# EAGLE design braeburn1 (EAGLE 6.1)
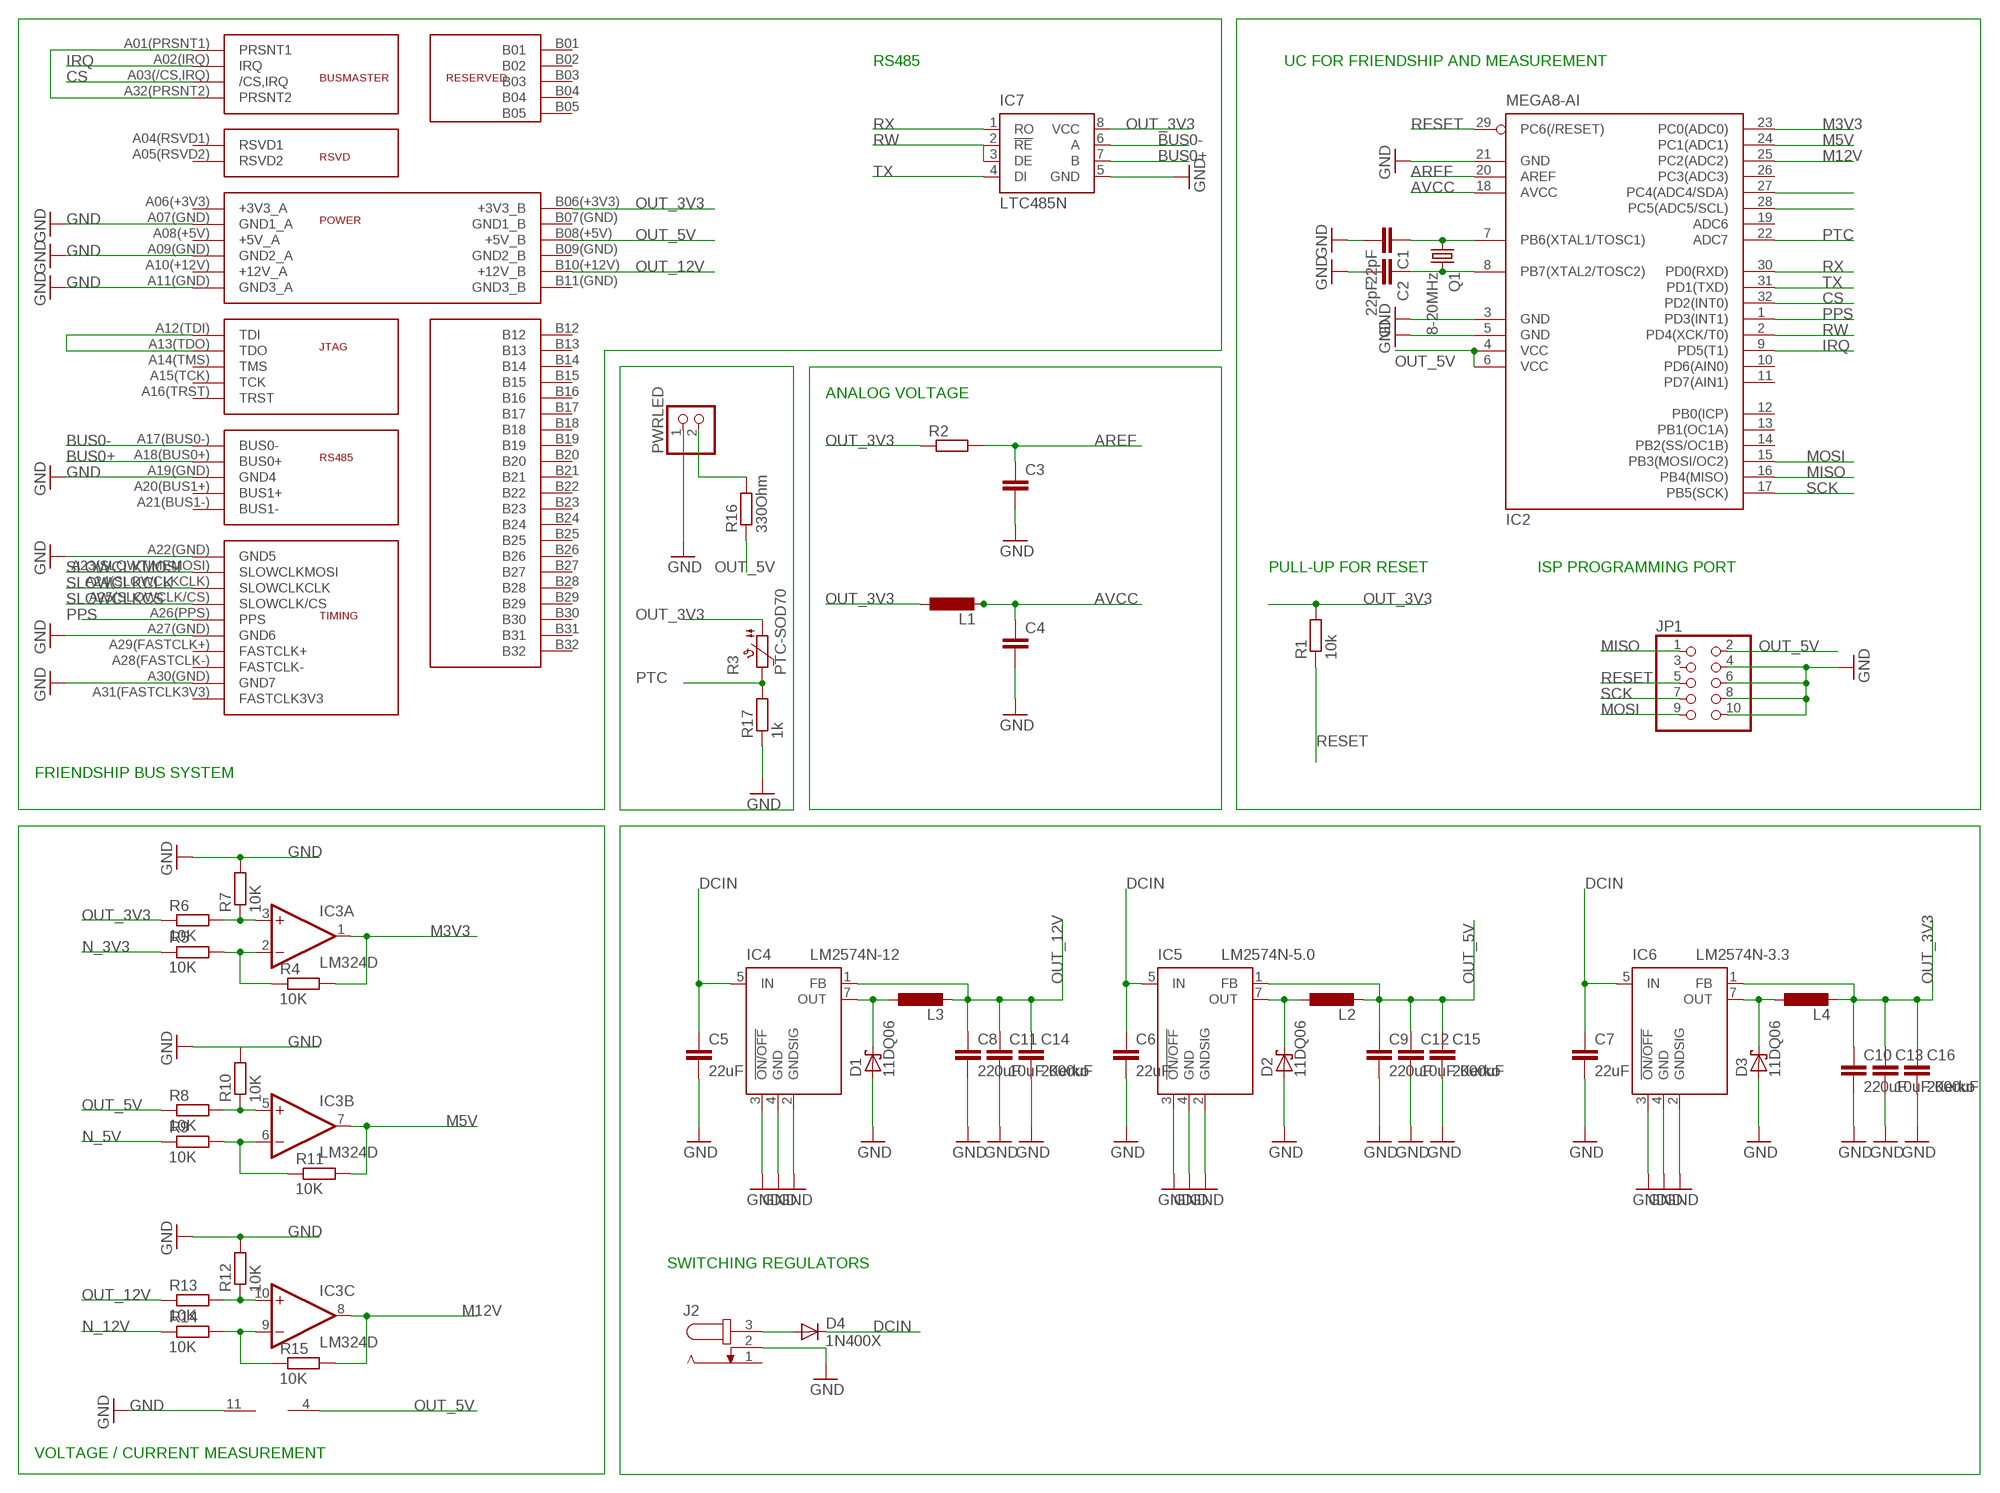
[diagram p0: schematic, sheet 1]

## Parts
C1  22pF  C-EUC0603  [C0603]
C2  22pF  C-EUC0603  [C0603]
C3  C-EUC0603  [C0603]
C4  C-EUC0603  [C0603]
C5  22uF  C-EU025-050X050  [C025-050X050]
C6  22uF  C-EU025-050X050  [C025-050X050]
C7  22uF  C-EU025-050X050  [C025-050X050]
C8  220uF  C-EU025-050X050  [C025-050X050]
C9  220uF  C-EU025-050X050  [C025-050X050]
C10  220uF  C-EU025-050X050  [C025-050X050]
C11  10uF Kerko  C-EUC0603  [C0603]
C12  10uF Kerko  C-EUC0603  [C0603]
C13  10uF Kerko  C-EUC0603  [C0603]
C14  2000uF  C-EU050-075X075  [C050-075X075]
C15  2000uF  C-EU050-075X075  [C050-075X075]
C16  2000uF  C-EU050-075X075  [C050-075X075]
D1  11DQ06  1N5817-B  [DO41-7.6]
D2  11DQ06  1N5817-B  [DO41-7.6]
D3  11DQ06  1N5817-B  [DO41-7.6]
D4  1N400X  1N4004  [DO41-10]
IC2  MEGA8-AI  [TQFP32-08]
IC3  LM324D  [SO14]
IC4  LM2574N-12  [DIL08]
IC5  LM2574N-5.0  [DIL08]
IC6  LM2574N-3.3  [DIL08]
IC7  LTC485N  [DIL08]
J2  JACK-PLUG0  [SPC4077]
JP1  PINHD-2X5  [2X05]
L1  L-EU0207/5V  [0207/5V]
L2  L-EUPIS2816  [PIS2816]
L3  L-EUPIS2816  [PIS2816]
L4  L-EUPIS2816  [PIS2816]
PWRLED  PINHD-1X2  [1X02]
Q1  8-20MHz  CRYSTALHC49S  [HC49/S]
R1  10k  R-EU_R0603  [R0603]
R2  R-EU_R0603  [R0603]
R3  PTC-SOD70  [SOD70]
R4  10K  R-EU_R0603  [R0603]
R5  10K  R-EU_R0603  [R0603]
R6  10K  R-EU_R0603  [R0603]
R7  10K  R-EU_R0603  [R0603]
R8  10K  R-EU_R0603  [R0603]
R9  10K  R-EU_R0603  [R0603]
R10  10K  R-EU_R0603  [R0603]
R11  10K  R-EU_R0603  [R0603]
R12  10K  R-EU_R0603  [R0603]
R13  10K  R-EU_R0603  [R0603]
R14  10K  R-EU_R0603  [R0603]
R15  10K  R-EU_R0603  [R0603]
R16  330Ohm  R-EU_R0603  [R0603]
R17  1k  R-EU_0207/12  [0207/12]
U$1  FRIENDSHIPCONNECTOR  [FRIENDSHIP_EDGE_CONNECTOR]

## Nets
AREF: C3.1 IC2.20(AREF) R2.2
AVCC: C4.1 IC2.18(AVCC) L1.2
BUS0+: IC7.7(B) U$1.A18(BUS0+)(BUS0+)
BUS0-: IC7.6(A) U$1.A17(BUS0-)(BUS0-)
CS: IC2.32(PD2(INT0)) U$1.A03(/CS,IRQ)(/CS,IRQ)
DCIN: C5.1 C6.1 C7.1 D4.C IC4.5(IN) IC5.5(IN) IC6.5(IN)
GND: C1.2 C2.2 C3.2 C4.2 C5.2 C6.2 C7.2 C8.2 C9.2 C10.2 C11.2 C12.2 C13.2 C14.2 C15.2 C16.2 D1.A D2.A D3.A IC2.3(GND) IC2.5(GND) IC2.21(GND) IC3.11(P:V-) IC4.2(GNDSIG) IC4.3(!ON/OFF) IC4.4(GND) IC5.2(GNDSIG) IC5.3(!ON/OFF) IC5.4(GND) IC6.2(GNDSIG) IC6.3(!ON/OFF) IC6.4(GND) IC7.5(GND) J2.2 JP1.4 JP1.6 JP1.8 JP1.10 PWRLED.1 R7.2 R10.2 R12.2 R17.1 U$1.A07(GND)(GND1_A) U$1.A09(GND)(GND2_A) U$1.A11(GND)(GND3_A) U$1.A19(GND)(GND4) U$1.A22(GND)(GND5) U$1.A30(GND)(GND7)
IRQ: IC2.9(PD5(T1)) U$1.A02(IRQ)(IRQ)
M3V3: IC2.23(PC0(ADC0)) IC3.1(A:OUT) R4.2
M5V: IC2.24(PC1(ADC1)) IC3.7(B:OUT) R11.2
M12V: IC2.25(PC2(ADC2)) IC3.8(C:OUT) R15.2
MISO: IC2.16(PB4(MISO)) JP1.1
MOSI: IC2.15(PB3(MOSI/OC2)) JP1.9
N$1: U$1.A01(PRSNT1)(PRSNT1) U$1.A32(PRSNT2)(PRSNT2)
N$2: U$1.A12(TDI)(TDI) U$1.A13(TDO)(TDO)
N$4: C1.1 IC2.7(PB6(XTAL1/TOSC1)) Q1.1
N$5: C2.1 IC2.8(PB7(XTAL2/TOSC2)) Q1.2
N$7: IC3.2(A:-IN) R4.1 R5.2
N$8: IC3.3(A:+IN) R6.2 R7.1
N$11: IC2.27(PC4(ADC4/SDA))
N$12: IC2.28(PC5(ADC5/SCL))
N$14: IC3.6(B:-IN) R9.2 R11.1
N$15: D4.A J2.3
N$16: IC3.5(B:+IN) R8.2 R10.1
N$18: PWRLED.2 R16.2
N$20: IC3.10(C:+IN) R12.1 R13.2
N$21: IC3.9(C:-IN) R14.2 R15.1
N_3V3: D3.C IC6.7(OUT) L4.1 R5.1
N_5V: D2.C IC5.7(OUT) L2.1 R9.1
N_12V: D1.C IC4.7(OUT) L3.1 R14.1
OUT_3V3: C10.1 C13.1 C16.1 IC6.1(FB) IC7.8(VCC) L1.1 L4.2 R1.2 R2.1 R3.1 R6.1 U$1.B06(+3V3)(+3V3_B)
OUT_5V: C9.1 C12.1 C15.1 IC2.4(VCC) IC2.6(VCC) IC3.4(P:V+) IC5.1(FB) JP1.2 L2.2 R8.1 R16.1 U$1.B08(+5V)(+5V_B)
OUT_12V: C8.1 C11.1 C14.1 IC4.1(FB) L3.2 R13.1 U$1.B10(+12V)(+12V_B)
PPS: IC2.1(PD3(INT1)) U$1.A26(PPS)(PPS)
PTC: IC2.22(ADC7) R3.2 R17.2
RESET: IC2.29(PC6(/RESET)) JP1.5 R1.1
RW: IC2.2(PD4(XCK/T0)) IC7.2(!RE) IC7.3(DE)
RX: IC2.30(PD0(RXD)) IC7.1(RO)
SCK: IC2.17(PB5(SCK)) JP1.7
SLOWCLKCLK: U$1.A24(SLOWCLKCLK)(SLOWCLKCLK)
SLOWCLKCS: U$1.A25(SLOWCLK/CS)(SLOWCLK/CS)
SLOWCLKMOSI: U$1.A23(SLOWTIMEMOSI)(SLOWCLKMOSI)
TX: IC2.31(PD1(TXD)) IC7.4(DI)
Unconnected: IC2.10(PD6(AIN0)) IC2.11(PD7(AIN1)) IC2.12(PB0(ICP)) IC2.13(PB1(OC1A)) IC2.14(PB2(SS/OC1B)) IC2.19(ADC6) IC2.26(PC3(ADC3)) IC3.12(D:+IN) IC3.13(D:-IN) IC3.14(D:OUT) J2.1 JP1.3 U$1.A04(RSVD1)(RSVD1) U$1.A05(RSVD2)(RSVD2) U$1.A06(+3V3)(+3V3_A) U$1.A08(+5V)(+5V_A) U$1.A10(+12V)(+12V_A) U$1.A14(TMS)(TMS) U$1.A15(TCK)(TCK) U$1.A16(TRST)(TRST) U$1.A20(BUS1+)(BUS1+) U$1.A21(BUS1-)(BUS1-) U$1.A27(GND)(GND6) U$1.A28(FASTCLK-)(FASTCLK-) U$1.A29(FASTCLK+)(FASTCLK+) U$1.A31(FASTCLK3V3)(FASTCLK3V3) U$1.B01 U$1.B02 U$1.B03 U$1.B04 U$1.B05 U$1.B07(GND)(GND1_B) U$1.B09(GND)(GND2_B) U$1.B11(GND)(GND3_B) U$1.B12 U$1.B13 U$1.B14 U$1.B15 U$1.B16 U$1.B17 U$1.B18 U$1.B19 U$1.B20 U$1.B21 U$1.B22 U$1.B23 U$1.B24 U$1.B25 U$1.B26 U$1.B27 U$1.B28 U$1.B29 U$1.B30 U$1.B31 U$1.B32

## Notes on the sheet
- RS485 | UC FOR FRIENDSHIP AND MEASUREMENT
- ANALOG VOLTAGE
- PULL-UP FOR RESET | ISP PROGRAMMING PORT
- FRIENDSHIP BUS SYSTEM
- SWITCHING REGULATORS
- VOLTAGE / CURRENT MEASUREMENT

## Library data of the parts
C1-C16 = rcl:C-EU: CAPACITOR, European symbol
D1-D3 = diode:1N581*: 1.0A SCHOTTKY BARRIER RECTIFIER Source: http://www.diodes.com/datasheets/ds23001.pdf
D4 = diode:1N4004: DIODE general purpose rectifier, 1 A
IC2 = atmel:MEGA8: MICROCONTROLLER 8 Kbytes FLASH, 1 kbytes SRAM, 512 bytes EEPROM, USART, 6-channel 10 bit ADC, 2-channel 8 bit ADC Pin compatible with Atmega48, ATMega88, ATMega168 Source: avr.lbr; MPN: ATMEGA8-16AU; OC_FARNELL: 9171371; OC_NEWARK: 73M8863
IC3 = linear:LM324: OP AMP
IC4-IC6 = linear:LM2574?-*: SIMPLE SWITCHER 0.5A Step-Down Voltage Regulator Source: http://cache.national.com/ds/LM/LM2574.pdf
IC7 = linear-technology:LTC485: Low Power RS485 Interface Transceiver Source: http://www.linear.com/pc/downloadDocument.do?navId=H0,C1,C1007,C1017,P2064,D1718; OC_FARNELL: unknown; OC_NEWARK: unknown
J2 = con-jack:JACK-PLUG: DC POWER JACK Power Jack, DC, Right Angle, Through Hole, Rated 5A at 16VDC, PC Terminals Distributor: Farnell (www.Farnell.de) Drawing: 84N1161.pdf / 84N1162.pdf Manufacturer: SPC Technology (www.spctechnology.com) Type: SPC4077 / SPC 4078; OC_FARNELL: unknown; OC_NEWARK: unknown
JP1 = pinhead:PINHD-2X5: PIN HEADER
L1-L4 = rcl:L-EU: INDUCTOR, European symbol
PWRLED = pinhead:PINHD-1X2: PIN HEADER
Q1 = crystal:CRYSTAL: CRYSTAL; OC_FARNELL: 1667008; OC_NEWARK: unknown
R1 R2 R4-R17 = rcl:R-EU_: RESISTOR, European symbol
R3 = ptc-ntc:PTC-: Positive Temperature Coefficient Resistor (PTC) termistor Philips KTY81-210 - KTY81-252 Source: 153627-da-01-en-Temperatur-Sensor_KTY10-6_Philips.pdf; OC_FARNELL: unknown; OC_NEWARK: unknown
U$1 = hgg:FRIENDSHIP

## Board
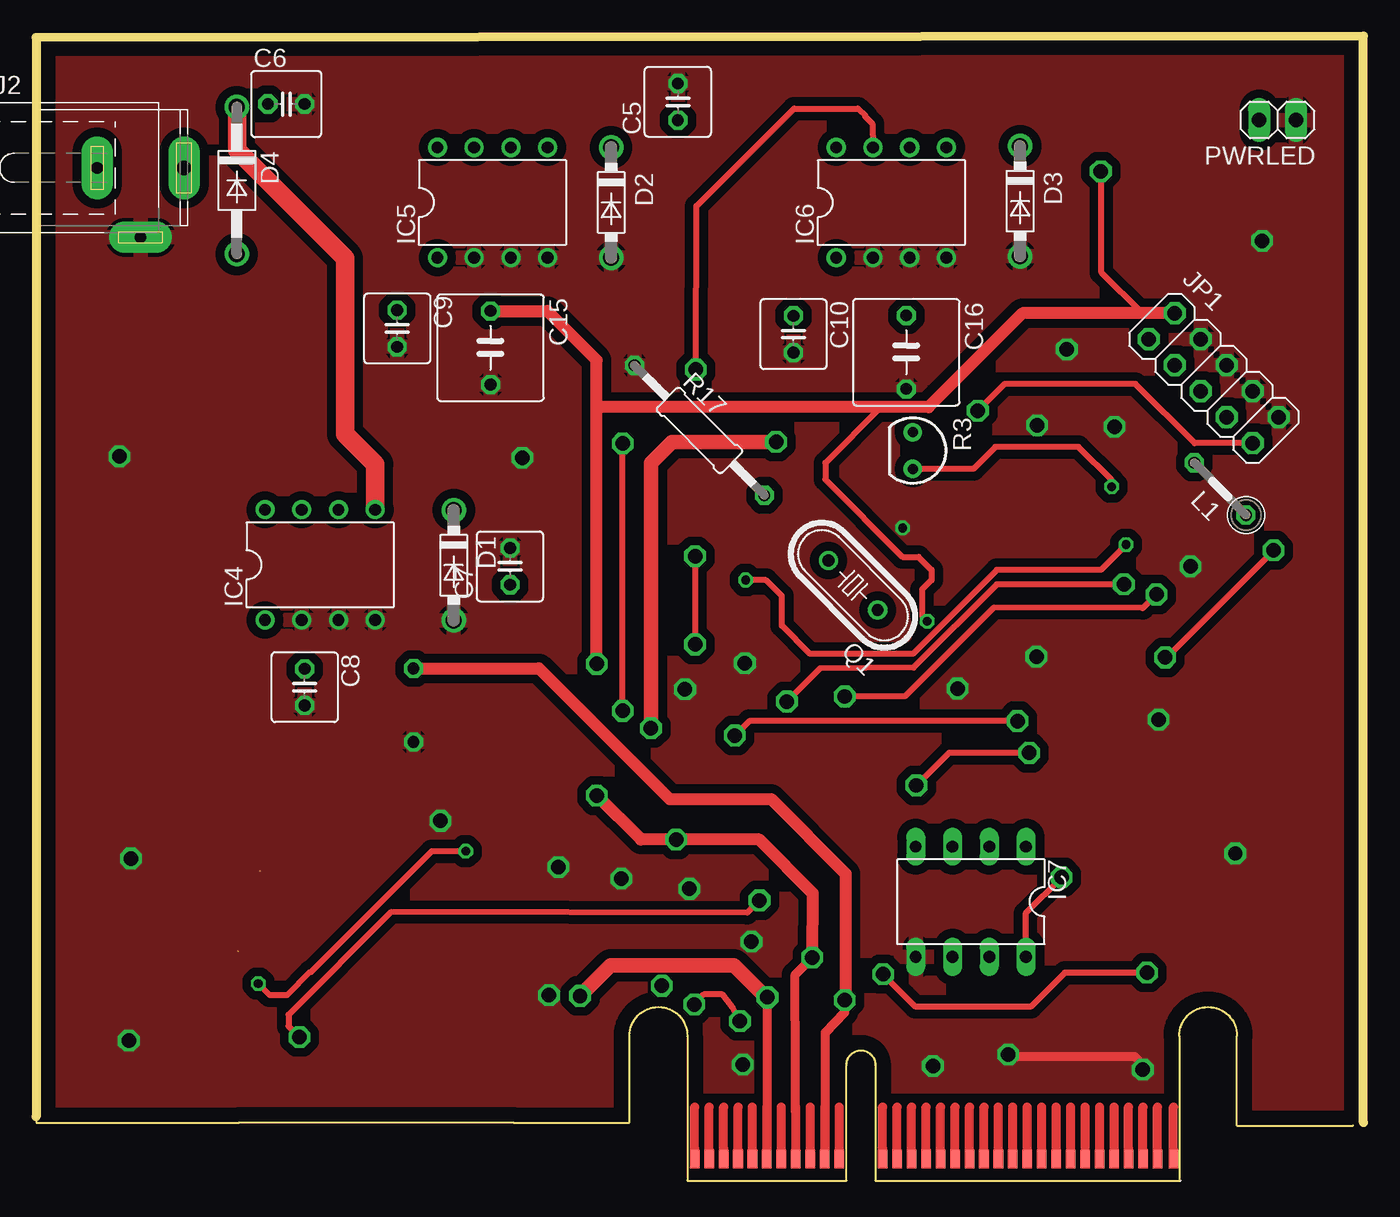
[diagram p1: board, top side]
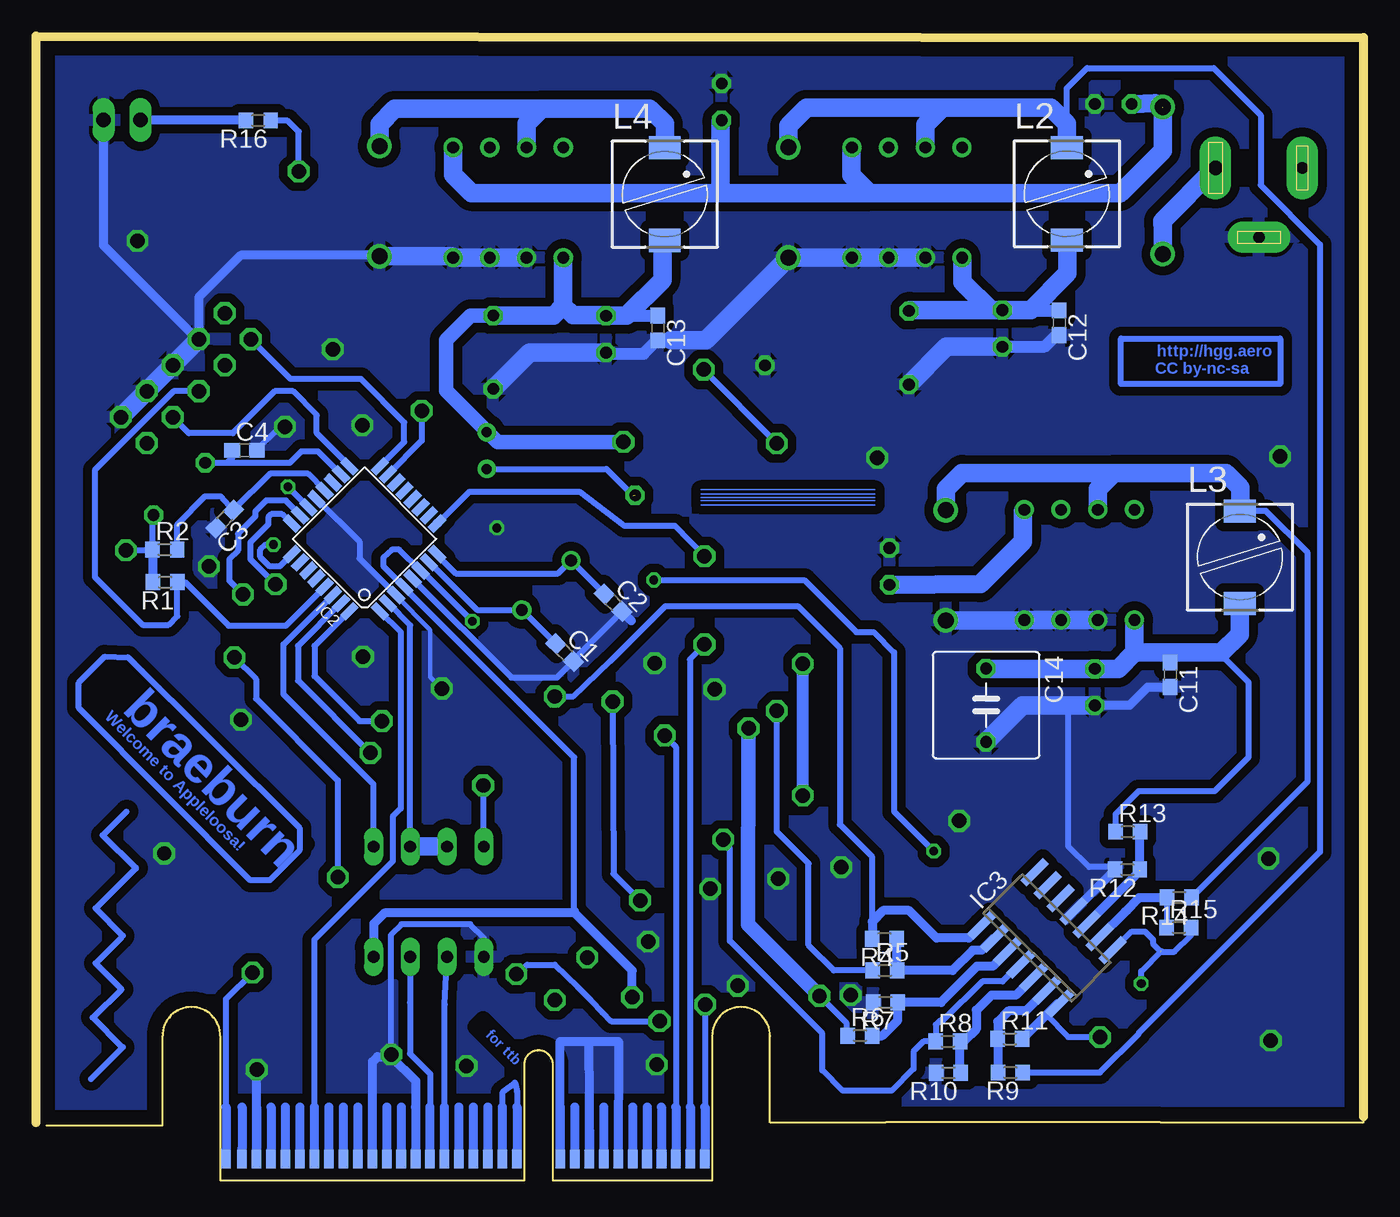
[diagram p2: board, bottom side, seen from below]

Size 91.75 x 79.12 mm. Coordinates in mm from the lower left corner, seen from the top.
Outline: 91.75,4.02 91.75,79.12 0,79.02 0,4.42
Copper layers (1*16): Top 0.035mm / dielectric 1.5mm / Bottom 0.035mm
Design rules: minimum track width 10mil, minimum drill 24mil, track to track 8mil, track to pad 8mil, pad to pad 8mil, via to via 8mil, smd to smd 8mil, copper to edge 40mil, drill to drill 8mil, minimum pad ring 10mil, minimum via ring 8mil, stop-mask expansion 4mil, vias tented up to drill 0mil, thermal gap 10mil

### Footprints (pad centres in the part's own frame; a part is rotated, then mirrored left to right if it is on the bottom)
C0603 = smd 1.1 x 1: 1 -0.85,0; 2 0.85,0
C025-050X050 = drill 0.813 octagon: 1 -1.27,0; 2 1.27,0
C050-075X075 = drill 0.813 octagon: 1 -2.54,0; 2 2.54,0
DO41-7.6 = drill 1.1 pad 1.7: A 3.81,0; C -3.81,0
DO41-10 = drill 1.118: A 5.08,0; C -5.08,0
TQFP32-08 = smd 1.27 x 0.559: 1 -4.293,2.8; 2 -4.293,2; 3 -4.293,1.2; 4 -4.293,0.4; 5 -4.293,-0.4; 6 -4.293,-1.2; 7 -4.293,-2; 8 -4.293,-2.8; 17 4.293,-2.8; 18 4.293,-2; 19 4.293,-1.2; 20 4.293,-0.4; 21 4.293,0.4; 22 4.293,1.2; 23 4.293,2; 24 4.293,2.8 | smd 0.559 x 1.27: 9 -2.8,-4.293; 10 -2,-4.293; 11 -1.2,-4.293; 12 -0.4,-4.293; 13 0.4,-4.293; 14 1.2,-4.293; 15 2,-4.293; 16 2.8,-4.293; 25 2.8,4.293; 26 2,4.293; 27 1.2,4.293; 28 0.4,4.293; 29 -0.4,4.293; 30 -1.2,4.293; 31 -2,4.293; 32 -2.8,4.293
SO14 = smd 0.6 x 2.2: 1 -3.81,-2.6; 2 -2.54,-2.6; 3 -1.27,-2.6; 4 0,-2.6; 5 1.27,-2.6; 6 2.54,-2.6; 7 3.81,-2.6; 8 3.81,2.6; 9 2.54,2.6; 10 1.27,2.6; 11 0,2.6; 12 -1.27,2.6; 13 -2.54,2.6; 14 -3.81,2.6
DIL08 = drill 0.813 pad 1.27: 1 -3.81,-3.81; 2 -1.27,-3.81; 3 1.27,-3.81; 4 3.81,-3.81; 5 3.81,3.81; 6 1.27,3.81; 7 -1.27,3.81; 8 -3.81,3.81
DIL08' = drill 0.813 long: 1 -3.81,-3.81; 2 -1.27,-3.81; 3 1.27,-3.81; 4 3.81,-3.81; 5 3.81,3.81; 6 1.27,3.81; 7 -1.27,3.81; 8 -3.81,3.81
SPC4077 = drill 0.8 pad 2.184 long: 1 -3,0; 2 0,-4.8 | drill 1 pad 2.184 long: 3 3,0
2X05 = drill 1.016 octagon: 1 -5.08,-1.27; 2 -5.08,1.27; 3 -2.54,-1.27; 4 -2.54,1.27; 5 0,-1.27; 6 0,1.27; 7 2.54,-1.27; 8 2.54,1.27; 9 5.08,-1.27; 10 5.08,1.27
0207/5V = drill 0.813 octagon: 1 -2.54,0; 2 2.54,0
PIS2816 = smd 2.2 x 1.6: 1 0,3.2; 2 0,-3.2
1X02 = drill 1.016 long: 1 -1.27,0; 2 1.27,0
HC49/S = drill 0.813: 1 -2.413,0; 2 2.413,0
R0603 = smd 1 x 1.1: 1 -0.85,0; 2 0.85,0
SOD70 = drill 0.7 pad 1.27: 1 -1.27,0; 2 1.27,0
0207/12 = drill 0.813 octagon: 1 -6.35,0; 2 6.35,0
FRIENDSHIP_EDGE_CONNECTOR = smd 0.66 x 1.27 bottom: A01(PRSNT1) 45.5,-14.5; A02(IRQ) 46.5,-14.5; A03(/CS,IRQ) 47.5,-14.5; A04(RSVD1) 48.5,-14.5; A05(RSVD2) 49.5,-14.5; A06(+3V3) 50.5,-14.5; A07(GND) 51.5,-14.5; A08(+5V) 52.5,-14.5; A09(GND) 53.5,-14.5; A10(+12V) 54.5,-14.5; A11(GND) 55.5,-14.5; A12(TDI) 58.5,-14.5; A13(TDO) 59.5,-14.5; A14(TMS) 60.5,-14.5; A15(TCK) 61.5,-14.5; A16(TRST) 62.5,-14.5; A17(BUS0-) 63.5,-14.5; A18(BUS0+) 64.5,-14.5; A19(GND) 65.5,-14.5; A20(BUS1+) 66.5,-14.5; A21(BUS1-) 67.5,-14.5; A22(GND) 68.5,-14.5; A23(SLOWTIMEMOSI) 69.5,-14.5; A24(SLOWCLKCLK) 70.5,-14.5; A25(SLOWCLK/CS) 71.5,-14.5; A26(PPS) 72.5,-14.5; A27(GND) 73.5,-14.5; A28(FASTCLK-) 74.5,-14.5; A29(FASTCLK+) 75.5,-14.5; A30(GND) 76.5,-14.5; A31(FASTCLK3V3) 77.5,-14.5; A32(PRSNT2) 78.6,-14.5 | smd 0.66 x 1.27: B01 45.5,-14.5; B02 46.5,-14.5; B03 47.5,-14.5; B04 48.5,-14.5; B05 49.5,-14.5; B06(+3V3) 50.5,-14.5; B07(GND) 51.5,-14.5; B08(+5V) 52.5,-14.5; B09(GND) 53.5,-14.5; B10(+12V) 54.5,-14.5; B11(GND) 55.5,-14.5; B12 58.5,-14.5; B13 59.5,-14.5; B14 60.5,-14.5; B15 61.5,-14.5; B16 62.5,-14.5; B17 63.5,-14.5; B18 64.5,-14.5; B19 65.5,-14.5; B20 66.5,-14.5; B21 67.5,-14.5; B22 68.5,-14.5; B23 69.5,-14.5; B24 70.5,-14.5; B25 71.5,-14.5; B26 72.5,-14.5; B27 73.5,-14.5; B28 74.5,-14.5; B29 75.5,-14.5; B30 76.5,-14.5; B31 77.5,-14.5; B32 78.6,-14.5

### Placement (x,y rotation side)
C1  55.21,36.5 315 bottom
C2  51.86,39.95 315 bottom
C3  78.72,45.74 225 bottom
C4  77.34,50.49 0 bottom
C5  44.36,74.58 90 top
C6  17.29,74.43 0 top
C7  32.76,42.46 90 top
C8  18.56,34.11 270 top
C9  24.96,58.91 270 top
C10  52.35,58.52 270 top
C11  13.35,34.97 270 bottom
C12  21.02,59.31 270 bottom
C13  48.77,58.94 270 bottom
C14  26.08,32.87 270 bottom
C15  31.41,57.58 270 top
C16  60.15,57.27 270 top
D1  28.87,42.54 270 top
D2  39.75,67.62 270 top
D3  68.02,67.71 270 top
D4  13.87,69.14 270 top
IC2  69.05,44.37 135 bottom
IC3  21.87,16.78 315 bottom
IC4  19.63,42.57 0 top
IC5  31.55,67.62 0 top
IC6  59.12,67.62 0 top
IC7  LTC485N  [DIL08']  64.62,19.28 180 top
J2  7.22,70.02 0 top
JP1  81.4,55.47 315 top
L1  81.85,47.82 134.7 top
L2  20.5,68.22 0 bottom
L3  8.53,43.1 0 bottom
L4  48.29,68.2 0 bottom
PWRLED  85.82,73.32 180 top
Q1  56.47,41.16 135 top
R1  82.83,41.37 180 bottom
R2  82.85,43.62 0 bottom
R3  60.6,50.47 270 top
R4  33.1,16.72 180 bottom
R5  33.07,14.52 0 bottom
R6  34.79,10.02 0 bottom
R7  33.04,12.32 180 bottom
R8  28.73,9.62 0 bottom
R9  24.4,7.47 180 bottom
R10  28.69,7.45 180 bottom
R11  24.43,9.79 0 bottom
R12  16.3,21.5 180 bottom
R13  16.29,24.12 0 bottom
R14  12.71,19.57 180 bottom
R15  12.75,17.49 0 bottom
R16  76.39,73.29 180 bottom
R17  45.85,51.87 315 top
U$1  0.02,16 0 top

### Tracks (layer width: path | path; a pad name or v marks a point on that pad's centre or on a via)
AREF
  Bottom 0.406: IC2.20 71.8,47.72 72.95,48.87 75.59,48.87 C3.1 79,47.32 80.05,47.32 82,45.37 R2.2
AVCC
  Bottom 0.406: L1.2 78.55,49.62 | 78.55,49.62 74.19,49.62 73.4,50.42 72.28,50.42 IC2.18 | C4.1 78.19,49.98 78.55,49.62
BUS0+
  Bottom 0.406: IC7.7 65.9,12.31 65.9,8.77 64.5,7.37 64.5,1.47 64.55,1.47
  Bottom 0.61: U$1.A18(BUS0+) 64.55,1.47
BUS0-
  Bottom 0.406: U$1.A17(BUS0-) 63.5,1.52 63.5,12.17 IC7.6
CS  (via drill 1)
  Top 0.406: v67.85,31.77 49.3,31.77 v48.3,30.77
  Bottom 0.406: IC2.32 72.5,36.97 72.5,34.87 69.4,31.77 v67.85,31.77 | v48.3,30.77 47.52,29.99 U$1.A03(/CS,IRQ)
DCIN  (1 unrouted)
  Top 1.27: IC4.5 23.44,49.53 21.35,51.62 21.35,63.77 13.9,71.22 13.9,74.22 13.95,74.27
  Bottom 1.27: 34.15,68.27 16.8,68.27 13.87,71.2 D4.C 14.4,74.5 C6.1 | 34.15,68.27 35.4,69.52 35.4,71.39 IC5.5 | IC6.5 62.93,69.55 61.65,68.27 44.45,68.27 | 44.45,68.27 34.15,68.27 | IC4.5 23.55,46.27 23.55,44.17 26.49,41.23 C7.1 | C5.1 44.45,73.22 44.45,68.27
GND  (via drill 0.6, 1)
  Top 0.61: v76.5,7.67 76.5,8.02 75.95,8.57 67.35,8.57 v67.2,8.72
  Bottom 0.305: IC2.3 66.86,40.43 64.5,38.07 64.5,34.82 v63.7,34.02
  Bottom 0.406: IC2.5 65.73,41.6 58.9,34.77 55.75,34.77 54.62,35.9 C1.2 54.61,36 C2.2 | R12.2 17.32,21.67 18.95,21.67 20.4,23.12 20.4,32.84 | IC2.21 72.35,47.12 69.4,44.17 69.4,43.02 IC2.3 | U$1.A19(GND) 65.5,1.52 | 60.8,16.77 61.75,17.72 66.5,17.72 67.2,17.02 v67.2,8.72 | 53.5,1.37 53.45,1.42 53.5,1.52 53.45,9.62 | C4.2 74.86,52.12 v74.55,52.12
  Bottom 0.61: IC3.11 R12.2 | C8.2 18.53,32.87 16.15,32.87 14.9,34.12 C11.2 | PWRLED.1 87.09,64.65 80.6,58.16 JP1.4 80.5,61.07 77.6,63.97 68.09,63.97 D3.A | 53.55,9.62 53.5,1.52 | 53.5,1.52 53.5,1.37 | C13.2 48.03,58.09 47.85,58.12 | 50.6,38.69 C2.2 | 65.5,1.52 65.5,6.87 67.2,8.57 v67.2,8.72 67.35,8.57 68.15,8.57 68.5,8.22 68.5,1.57 | U$1.A07(GND) 51.5,9.62 53.45,9.62 53.55,9.62 | 55.55,1.53 U$1.A11(GND) 55.52,9.62 53.55,9.62 | U$1.A09(GND) 53.5,1.52 | 68.55,1.62 68.5,1.57 | U$1.A30(GND) 76.52,7.65 v76.5,7.67 | 68.5,1.57 68.5,1.52 U$1.A22(GND)
  Bottom 0.813: C9.2 24.93,57.67 22,57.67 21.21,58.46 C12.2 | C10.2 52.27,57.17 49.75,57.17 48.83,58.09 C13.2
  Bottom 1.27: C15.2 28.81,57.64 C9.2 | IC5.2 IC5.3 IC5.4 D2.A 45.44,58.12 47.85,58.12 | IC6.2 IC6.3 IC6.4 63.02,63.9 D3.A | C16.2 57.63,57.25 C10.2 | IC4.2 IC4.3 IC4.4 23.47,38.73 D1.A 28.91,38.69 | C14.2 23.57,32.84 20.4,32.84 C8.2 | JP1.10 JP1.8 JP1.6 | JP1.6 | JP1.6 JP1.4 | JP1.4
  other vias: 69.15,36.22 79.8,42.47 35.45,12.82 45.15,20.17 43.25,13.47 6.4,9.67 49.45,16.52 44.85,33.97 5.75,50.07 82.9,22.62 84.75,64.97 33.6,49.97 27.95,24.87 6.55,22.27 49,35.77 71.25,57.47 69.2,52.22 36.1,21.67 40.45,20.87 48.85,8.02 77.6,31.87 62,7.92 59.9,45.12
  pour Bottom (isolate 0.61): -9.6,91.37 176.35,91.77 176.35,-13.18 -9.55,-13.58 -9.55,89.87
  pour Top (isolate 0.61): -2.5,101.62 99.7,101.97 98.15,-48.43 -4.3,-48.78 -4.55,99.07 -4.45,100.67 -4.45,100.72
IRQ  (via drill 1)
  Top 0.406: v45.55,43.17 v45.55,37.07
  Bottom 0.406: 63.99,45.42 61.8,47.62 54.2,47.62 51.1,45.27 47.6,45.27 v45.55,43.17 | v45.55,37.07 46.55,36.02 46.55,1.52
  Bottom 0.61: IC2.9 63.99,45.42 | 46.55,1.52 U$1.A02(IRQ)
M3V3  (via drill 1)
  Top 0.406: v77.45,40.52 76.5,39.57 66.2,39.62 60.05,33.47 v55.9,33.47
  Bottom 0.406: 33.95,17.92 33.95,22.37 36.2,24.62 36.2,36.82 39.1,39.72 48.25,39.72 52.05,35.92 54.6,33.47 v55.9,33.47 | 73.57,45.99 IC2.23 73.5,46.02 74.5,47.02 75.85,47.02 76.6,46.27 76.6,45.92 77.8,44.72 77.8,43.57 78.4,42.97 78.4,41.47 v77.45,40.52
  Bottom 0.61: IC3.1 27.27,16.77 29.5,16.77 31.4,18.67 33.2,18.67 33.95,17.92 R4.2
M5V  (via drill 1)
  Top 0.406: v75.2,41.22 66.4,41.22 60.65,35.47 54.2,35.42 v51.9,33.12 | 50.3,19.67 v50,19.37 49.15,18.52 24.55,18.57 17.45,11.47 17.45,10.67 v18.2,9.92
  Bottom 0.406: IC2.24 74.1,45.42 74.75,46.07 75.5,46.07 75.7,45.87 75.7,45.37 76.95,44.12 76.95,42.97 v75.2,41.22 | v51.9,33.12 51.85,21.22 v50,19.37 | v18.2,9.92 20.4,9.92 21.93,11.45
  Bottom 0.61: R11.2 21.93,11.45 21.12,12.25 IC3.7
M12V  (via drill 0.6)  (1 unrouted)
  Top 0.406: v75.35,43.97 73.6,42.22 66.4,42.22 60.6,36.42 53.5,36.42 51.55,38.37 51.55,40.42 50.45,41.52 v49.05,41.52 | v29.7,22.77 27.35,22.77 19,14.42 18.95,14.42 17.35,12.82 16.15,12.82 v15.35,13.62
  Bottom 0.406: IC3.8 15.99,17.22 15.1,17.22 14.55,16.67 14.55,16.37 14,15.82 13.05,15.82 11.9,16.97 R15.2 | IC2.25 74.91,42.47 75.6,42.47 76.25,43.12 76.25,43.62 75.9,43.97 v75.35,43.97 | v49.05,41.52 38.65,41.52 35.05,37.92 33.85,37.92 32.45,36.52 32.45,25.52 v29.7,22.77 | v15.35,13.62 15.35,14.47 13.95,15.87
MISO
  Bottom 0.406: IC2.16 66.3,51.07 66.3,52.42 69.3,55.42 74.17,55.42 JP1.1
MOSI  (via drill 1)
  Top 0.406: JP1.9 80.09,50.98 76,55.07 66.95,55.07 v65.1,53.22
  Bottom 0.406: v65.1,53.22 65.1,51.15 IC2.15
N$1  (via drill 1)
  Top 0.406: v76.8,14.37 71.1,14.37 68.75,12.02 60.8,12.02 v58.55,14.27 | v48.65,11.02 48.15,11.97 47.45,12.87 46.15,12.87 v45.5,12.17
  Bottom 0.406: U$1.A32(PRSNT2) 78.62,12.55 v76.8,14.37 | v58.55,14.27 57.8,14.92 55.9,14.92 54.3,13.37 53.4,12.47 52.6,11.62 52,11.02 v48.65,11.02 | v45.5,12.17 45.5,1.72 45.55,1.67 45.55,1.53 U$1.A01(PRSNT1)
N$2
  Bottom 0.406: U$1.A13(TDO) 59.5,1.52 59.5,6.12 59.45,6.17 58.65,6.77 58.52,6.15 U$1.A12(TDI)
N$3
  Bottom 0.406: 5.75,58.22 5.75,55.07 16.75,55.07 16.75,58.22 5.75,58.22
N$4
  Bottom 0.406: IC2.7 64.58,42.75 61.28,39.45 Q1.1 58.16,39.45 C1.1
N$5
  Bottom 0.406: IC2.8 64.03,43.25 62.75,41.97 55.66,41.97 Q1.2 54.76,42.85 C2.1
N$6
  Bottom 0.406: 87,36.22 85.4,36.17 73.55,24.37 73.55,22.82 75.6,20.77 76.95,20.77 88.8,32.67 88.8,34.42 87,36.22
N$7
  Bottom 0.61: IC3.2 25.58,16.74 26.4,15.92 27,15.92 28.4,14.52 R5.2 32.25,14.55 R4.1
N$8
  Bottom 0.61: IC3.3 25.63,14.82 26.7,14.82 29.2,12.32 R7.1 32.19,11.08 33.25,10.02 R6.2
N$9
  Bottom 0.406: 87.95,7.02 85.75,9.22 85.8,9.22 87.85,11.27 87.8,11.27 85.85,13.22 87.65,15.02 85.85,16.82
N$10
  Bottom 0.406: 85.75,16.92 87.65,18.82 84.85,21.62
N$13
  Bottom 0.406: 84.85,21.57 87.15,23.87 85.5,25.52
N$14
  Bottom 0.61: IC3.6 23.34,11.72 24.55,11.72 25.28,10.99 | 25.28,10.99 R11.1 | 25.28,10.99 25.25,10.96 R9.2
N$15
  Bottom 1.27: D4.A 13.87,66.09 13.9,66.12 13.9,66.34 J2.3
N$16
  Bottom 0.61: IC3.5 24.03,12.82 25.7,12.82 26.75,11.77 26.75,10.47 27.6,9.62 R8.2 27.88,7.49 R10.1
N$17
  Bottom 0.1: 33.75,47.77 45.8,47.77
N$18
  Bottom 0.61: R16.2 77.27,73.32 PWRLED.2
N$19
  Bottom 0.1: 33.75,47.47 45.8,47.47
N$20  (1 unrouted)
  Bottom 0.61: R13.2 15.5,24.06 15.5,21.42 | IC3.10 15.45,21.4 R12.1
N$21
  Bottom 0.406: R15.1 13.73,17.62 13.56,17.79 R14.2 | 16.27,18.59 16.47,18.59
  Bottom 0.61: IC3.9 16.47,18.59 15.49,19.57 R14.2
N$22
  Bottom 0.1: 33.75,47.22 45.8,47.22
N$23
  Bottom 0.1: 33.75,47.02 45.8,47.02
N$24
  Bottom 0.1: 33.75,46.72 45.8,46.72
N_3V3  (via drill 1)
  Top 0.406: v40.55,32.47 v40.55,50.97 | v45.6,56.07 45.65,67.37 52.4,74.12 56.8,74.12 57.35,73.57 57.3,73.57 57.8,73.07 IC6.7
  Bottom 0.406: R5.1 36.6,14.52 38.35,16.27 38.35,21.92 40.55,24.12 v40.55,32.47 | v40.55,50.97 v45.6,56.07
  Bottom 1.27: L4.1 48.29,73.06 49.35,74.12 56.8,74.12 56.83,74.09 | 56.83,74.09 57.85,73.07 IC6.7 | D3.C 68.02,73.05 66.97,74.09 56.83,74.09
N_5V
  Bottom 0.406: R9.1 18.2,7.47 15.55,10.12 15.55,10.17 3,22.72 3,64.72 7.1,68.82 7.1,73.67 10.35,76.92 19.1,76.92 20.5,75.52 L2.1
  Bottom 1.27: L2.1 20.5,73.07 21.6,74.17 29.1,74.17 | IC5.7 30.28,72.99 29.1,74.17 | D2.C 39.75,72.92 38.5,74.17 29.1,74.17
N_12V
  Bottom 0.406: R14.1 3.85,27.58 3.85,43.42 6.73,46.3 L3.1
  Bottom 1.27: L3.1 8.5,46.33 8.5,47.92 9.5,48.92 17.25,48.92 | 17.25,48.92 18.35,47.82 IC4.7 | D1.C 28.87,47.8 27.75,48.92 17.25,48.92
OUT_3V3  (via drill 1)
  Top 0.406: v85.55,43.57 78.15,36.17 v78.05,36.17 | v70.9,20.97 68.4,18.47 68.4,16.12 68.43,16.09 IC7.8
  Top 0.61: U$1.B06(+3V3) 50.55,1.53 v50.55,12.67 50.5,12.62
  Top 1.016: 50.5,12.62 48.25,14.87 39.7,14.87 v37.6,12.77 | v51.15,51.07 43.95,51.07 42.5,49.62 v42.5,31.27
  Bottom 0.406: L1.1 83.7,46 R2.1 83.75,43.57 v85.55,43.57 | IC7.8 68.4,14.84 | 54.55,18.62 54.55,29.27 66.3,41.02 | v37.6,12.77 35.75,10.92 35.75,10.13 R6.1 | v78.05,36.17 76.55,34.67 76.55,33.32 70.9,27.67 v70.9,20.97 | R3.1 59.93,51.07 59.85,51.07
  Bottom 0.61: 68.4,14.84 68.4,17.77 67.67,18.5 54.52,18.5 | 54.52,18.5 50.55,14.52 v50.55,12.67 | 54.52,18.5 54.55,18.62 | R6.1 | R2.1 83.7,41.39 R1.2
  Bottom 0.813: 50.93,59.79 C13.1
  Bottom 1.016: v42.5,31.27 42.55,17.72 v37.6,12.77 | C16.1 61.71,59.81 63.4,58.12 63.4,54.62 59.85,51.07 v51.15,51.07
  Bottom 1.27: IC6.1 55.31,60.48 | 55.31,60.48 54.65,59.82 52.38,59.82 C10.1 50.93,59.79 48.45,62.27 48.45,64.84 L4.2 | C16.1 55.98,59.81 55.31,60.48
OUT_5V  (via drill 0.6, 1)
  Top 0.406: JP1.2 76.46,59.96 73.65,62.77 73.65,69.72 v73.6,69.77 | 61.7,53.47 58.4,53.47 54.55,49.62 54.55,48.47 59.9,43.12 61,43.12 61.9,42.22 61.9,41.52 61.25,40.87 61.25,39.02 v61.6,38.67
  Top 0.61: U$1.B08(+5V) 52.47,14.24 v53.65,15.42
  Top 0.813: v53.65,15.42 53.7,19.87 50,23.57 v44.25,23.57 41.8,23.57 v38.75,26.62 | v38.75,35.72 38.75,53.42 | 38.75,53.42 38.75,56.72 35.35,60.12 C15.1 | JP1.2 68.19,59.96 61.7,53.47 38.8,53.47 38.75,53.42
  Bottom 0.406: v73.6,69.77 73.6,72.52 74.35,73.27 75.52,73.27 R16.1 | v44.25,23.57 43.8,22.97 43.8,16.57 37.4,10.17 37.4,7.62 36,6.22 32.6,6.22 31.1,7.72 31.1,8.92 30.4,9.62 R8.1 29.55,9.65 29.55,10.77 29.25,11.07 29.05,11.07 26.35,13.77 24.95,13.77 23.78,14.94 IC3.4 | IC2.4 67.75,42.5 67.75,43.07 67.15,43.62 66.65,43.62 IC2.6 65.11,42.18 v61.6,38.67
  Bottom 0.813: C9.1 24.94,60.16 C12.1 | v38.75,26.62 v38.75,35.72
  Bottom 1.27: IC5.1 27.7,63.77 27.7,62.12 25.76,60.18 | 25.76,60.18 C9.1 22.99,60.18 20.45,62.72 20.45,64.97 L2.2 | C15.1 31.35,60.18 25.76,60.18
OUT_12V  (via drill 1)
  Top 0.61: U$1.B10(+12V) 54.55,1.53 54.55,10.22 55.9,11.62 v55.9,12.47
  Top 0.813: C14.1 34.76,35.41 43.8,26.37 50.8,26.37 55.95,21.22 55.95,13.17 v55.9,12.47
  Bottom 0.406: 16.95,35.37 16.05,36.27 9.75,36.27 7.95,34.47 7.95,29.27 10.3,26.92 15.55,26.92 17.14,25.33 R13.1
  Bottom 0.813: 15.8,36.57 16.95,35.37 | C11.1 13.5,35.97 13.5,36.5
  Bottom 1.27: C14.1 26.05,35.38 C8.1 16.95,35.37 15.82,36.5 | 15.82,36.5 IC4.1 | L3.2 8.55,39.88 8.55,37.77 9.82,36.5 13.5,36.5 15.82,36.5
PPS
  Bottom 0.406: IC2.1 66.55,37.91 66.55,25.72 67.1,25.17 67.1,22.07 72.52,16.65 U$1.A26(PPS)
PTC  (via drill 0.6)  (1 unrouted)
  Top 0.406: v74.35,47.97 74.35,48.42 72.05,50.72 66.3,50.72 64.78,49.2 R3.2
  Bottom 0.406: R3.2 52.33,49.2 50.5,47.37 | IC2.22 v74.35,47.97
RESET
  Bottom 0.406: R1.1 81.45,41.37 78.45,38.37 74.48,38.37 IC2.29 | 82.05,41.3 R1.1 | JP1.5 82.25,54.57 87.7,49.12 87.7,41.72 84.4,38.42 82.6,38.42 82,39.02 82,41.35 R1.1
RW
  Bottom 0.406: IC7.2 65.89,38.38 IC2.2
  Bottom 1.27: IC7.2 IC7.3
RX
  Bottom 0.406: IC7.1 68.43,27.4 74.65,33.62 74.65,37.07 IC2.30
SCK
  Bottom 0.406: IC2.17 70.1,49.42 72.35,51.67 72.35,52.92 74,54.57 75.25,54.57 78.15,51.67 81.19,51.67 JP1.7
TX  (via drill 1)
  Top 0.406: v68.65,29.57 63.1,29.57 v60.85,27.32
  Bottom 0.406: IC2.31 70.7,39.92 73.65,36.97 73.65,34.57 v68.65,29.57 | v60.85,27.32 60.85,22.88 IC7.4

### Text on the board
Bottom: http://hgg.aero | CC by-nc-sa | braeburn | Welcome to Appleloosa! | for ttb